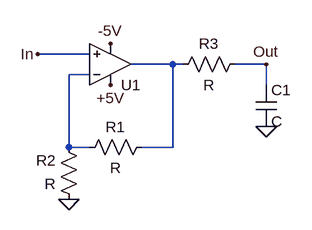
[diagram p0: schematic Draft2.asc]
Draft2.asc, the LTspice schematic file:
Version 4
SHEET 1 880 680
WIRE 144 96 64 96
WIRE 272 112 208 112
WIRE 288 112 272 112
WIRE 416 112 368 112
WIRE 144 128 112 128
WIRE 416 144 416 112
WIRE 112 240 112 128
WIRE 144 240 112 240
WIRE 272 240 272 112
WIRE 272 240 224 240
FLAG 176 80 -5V
FLAG 176 144 +5V
FLAG 112 320 0
FLAG 64 96 In
FLAG 416 208 0
FLAG 416 112 Out
SYMBOL OpAmps\\UniversalOpAmp 176 112 M180
SYMATTR InstName U1
SYMBOL res 240 224 R90
WINDOW 0 0 56 VBottom 2
WINDOW 3 32 56 VTop 2
SYMATTR InstName R1
SYMBOL res 128 336 R180
WINDOW 0 36 76 Left 2
WINDOW 3 36 40 Left 2
SYMATTR InstName R2
SYMBOL res 384 96 R90
WINDOW 0 0 56 VBottom 2
WINDOW 3 32 56 VTop 2
SYMATTR InstName R3
SYMBOL cap 400 144 R0
SYMATTR InstName C1

The netlist it stands for:
* Draft2.asc
XU1 In N002 +5V -5V N001 level1 Avol=1Meg GBW=10Meg Vos=0 En=0 Enk=0 In=0 Ink=0 Rin=500Meg  ; pins In+ In- V+ V- OUT
R1 N001 N002 R
R2 0 N002 R
R3 Out N001 R
C1 Out 0 C
.lib UniversalOpAmp1.lib
.backanno
.end